# EAGLE design Fox_Sound_Light (EAGLE 9.4.2)
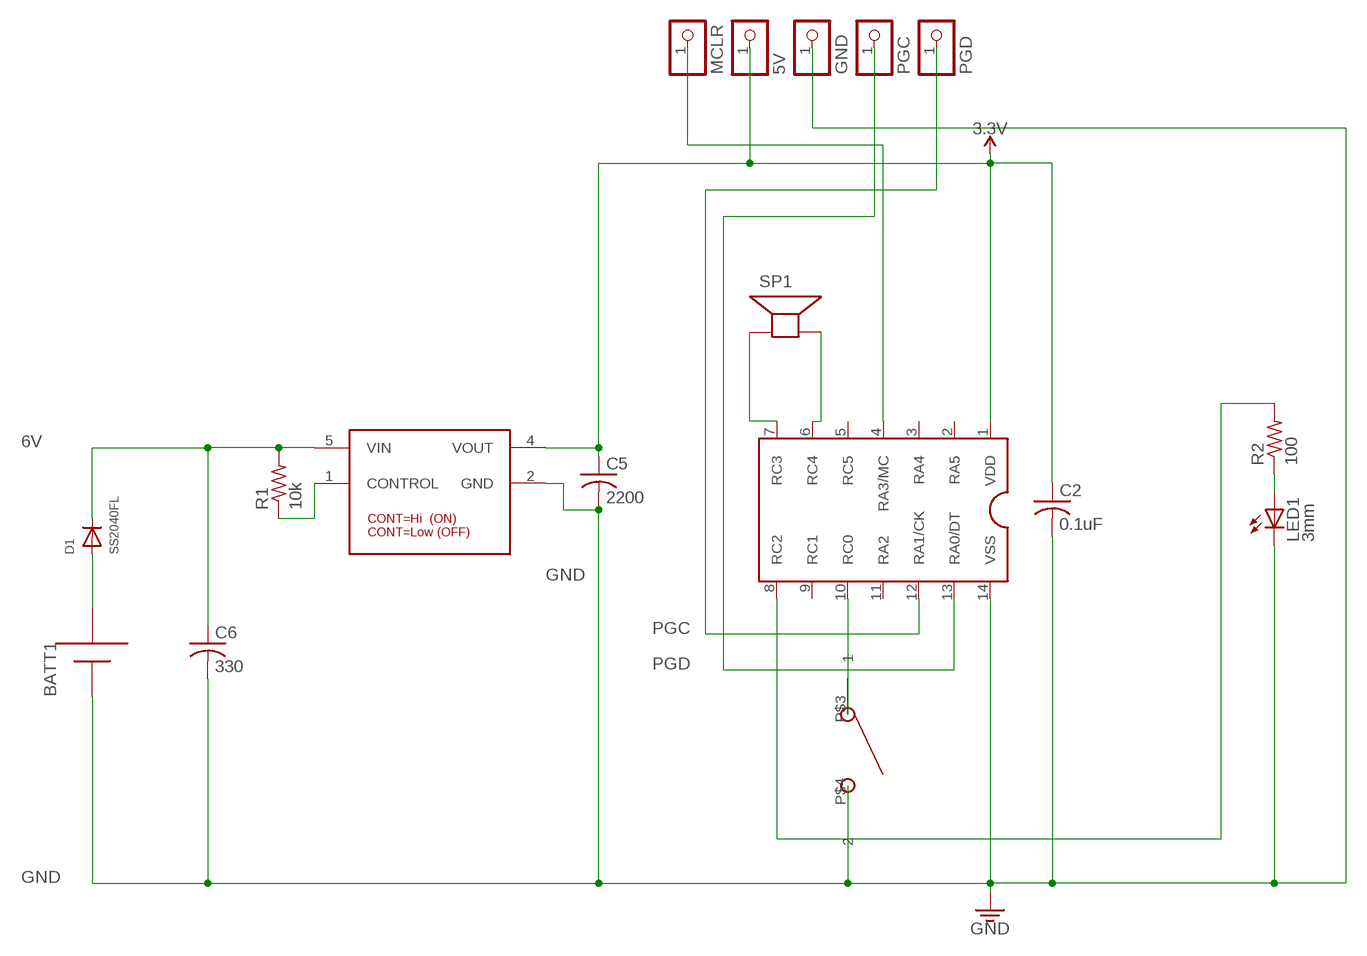
[diagram p0: schematic, sheet 1]

## Parts
BATT1  AAA_CR2032X2  [CR2032X2]
C2  0.1uF  C-USC0603  [C0603]
C5  2200  C-USC3216  [C3216]
C6  330  C-USC0603  [C0603]
D1  SS2040FL  DIODE_SOD-123FL  [SOD-123FL]
JP1  MCLR  PINHD-1X1CB  [1X01-CLEANBIG]
JP2  5V  PINHD-1X1CB  [1X01-CLEANBIG]
JP3  GND  PINHD-1X1CB  [1X01-CLEANBIG]
JP4  PGC  PINHD-1X1CB  [1X01-CLEANBIG]
JP5  PGD  PINHD-1X1CB  [1X01-CLEANBIG]
LED1  3mm  LED3MM  [LED3MM]
NJM2884  NJM2884  I-10673_NJM2884U1-33  [NJM2884U1-33]
R1  10k  R-US_R0603  [R0603]
R2  100  R-US_R0603  [R0603]
SP1  SPEAKER_MURATA  [MURATA_PIEZO]
U$1  LEAD-SWITCH_TILT  [TILT-SWITCH]
U$2  PIC16F1705SOP  [14PIN_SOP]

## Nets
3.3V: C2.1 C5.1 JP2.1 NJM2884.4(VOUT) U$2.1(VDD)
6V: C6.1 D1.C NJM2884.5(VIN) R1.2
GND: BATT1.GND(-) C2.2 C5.2 C6.2 JP3.1 LED1.K(C) NJM2884.2(GND) U$1.P$4 U$2.14(VSS)
N$1: NJM2884.1(CONTROL) R1.1
N$2: LED1.A R2.1
N$3: U$1.P$3 U$2.10(RC0)
N$4: SP1.2(-) U$2.6(RC4)
N$5: SP1.1(+) U$2.7(RC3)
N$6: R2.2 U$2.8(RC2)
N$7: JP1.1 U$2.4(RA3/MC)
N$8: BATT1.V(+) D1.A
PGC: JP5.1 U$2.12(RA1/CK)
PGD: JP4.1 U$2.13(RA0/DT)
Unconnected: U$2.2(RA5) U$2.3(RA4) U$2.5(RC5) U$2.9(RC1) U$2.11(RA2)

## Library data of the parts
BATT1 = MATHRAX-a:AAA: AAA PC pin holder Mouser part #12BH412 - but pretty much any 1x AAA battery holder should be the same http://www.ladyada.net/library/pcb/eaglelibrary.html
C2 C6 = mathrax:C-US: CAPACITOR, American symbol
C5 = MATHRAX-a:C-US: CAPACITOR, American symbol
D1 = MATHRAX-a:DIODE: Diode SMADIODE - SMA Surface Mount Package 20V 1A Schottky Diode Digikey: 641-1014-6-ND DO-1N4148 - Through Hole Small Current Diode SOD-123 20V 1 A (.5mV Vf) Schottky Diode - Digikey: MBRX120TPMSCT-ND SOD-323 10V 570mA (.38mV Vf, 3ns) Schottky Diode - Digikey: ZLLS410CT-ND SOD-523 30V 30mA Schottky Diode (RB751S-40TE61) - Digikey: RB751S-40TE61CT-ND SOT23-R/W - SOT23 Package (R = Solder Paste/Reflow Ovens, W = Hand-Soldering) BAT54Film 40V 300mA - Digikey: 497-7162-1-ND
JP1-JP5 = MATHRAX-a:PINHD-1X1: Pin header 1x1 for 0.1" spacing With round pins
LED1 = MATHRAX-a:LED: LED OSRAM: - CHIPLED LG R971, LG N971, LY N971, LG Q971, LY Q971, LO R971, LY R971 LH N974, LH R974 LS Q976, LO Q976, LY Q976 LO Q996 - Hyper CHIPLED LW Q18S LB Q993, LB Q99A, LB R99A - SideLED LS A670, LO A670, LY A670, LG A670, LP A670 LB A673, LV A673, LT A673, LW A673 LH A674 LY A675 LS A676, LA A676, LO A676, LY A676, LW A676 LS A679, LY A679, LG A679 - Hyper Micro SIDELED® LS Y876, LA Y876, LO Y876, LY Y876 LT Y87S - SmartLED LW L88C, LW L88S LB L89C, LB L89S, LG L890 LS L89K, LO L89K, LY L89K LS L896, LA L896, LO L896, LY L896 - TOPLED LS T670, LO T670, LY T670, LG T670, LP T670 LSG T670, LSP T670, LSY T670, LOP T670, LYG T670 LG T671, LOG T671, LSG T671 LB T673, LV T673, LT T673, LW T673 LH T674 LS T676, LA T676, LO T676, LY T676, LB T676, LH T676, LSB T676, LW T676 LB T67C, LV T67C, LT T67C, LS T67K, LO T67K, LY T67K, LW E67C LS E67B, LA E67B, LO E67B, LY E67B, LB E67C, LV E67C, LT E67C LW T67C LS T679, LY T679, LG T679 LS T770, LO T770, LY T770, LG T770, LP T770 LB T773, LV T773, LT T773, LW T773 LH T774 LS E675, LA E675, LY E675, LS T675 LS T776, LA T776, LO T776, LY T776, LB T776 LHGB T686 LT T68C, LB T68C - Hyper Mini TOPLED® LB M676 - Mini TOPLED Santana® LG M470 LS M47K, LO M47K, LY M47K Source: http://www.osram.convergy.de/
NJM2884 = mathrax:I-10673_NJM2884U1-33
R1 R2 = mathrax:R-US_: RESISTOR, American symbol
SP1 = MATHRAX-a:SPEAKER_MURATA: SPEAKER Source: Buerklin Added PS12 (for part # PS1240 piezo) http://www.ladyada.net/library/pcb/eaglelibrary.html
U$1 = mathrax:LEAD-SWITCH
U$2 = mathrax:PIC16F1705

## Board
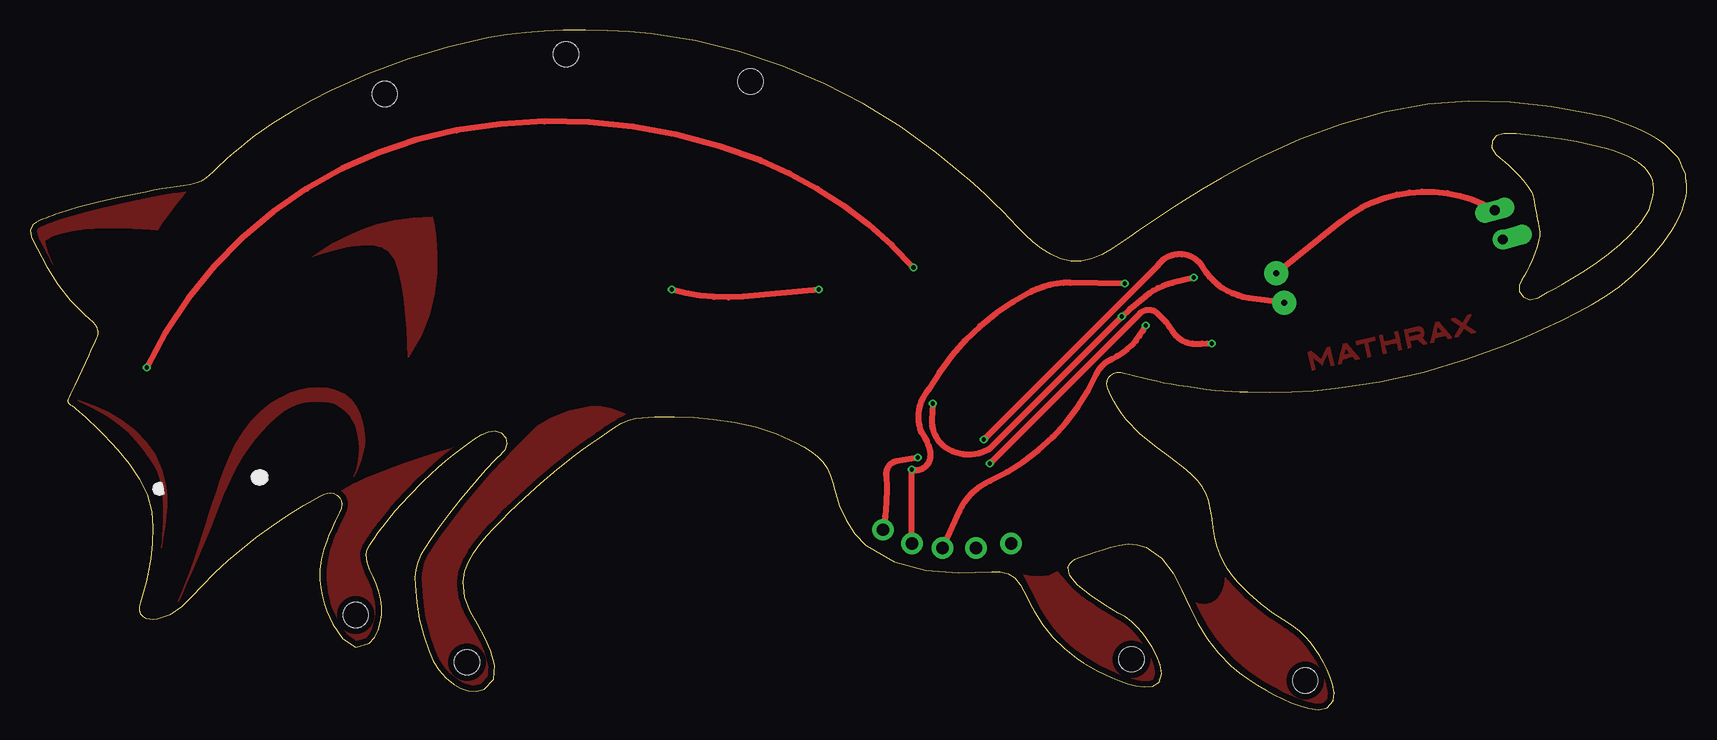
[diagram p1: board, top side]
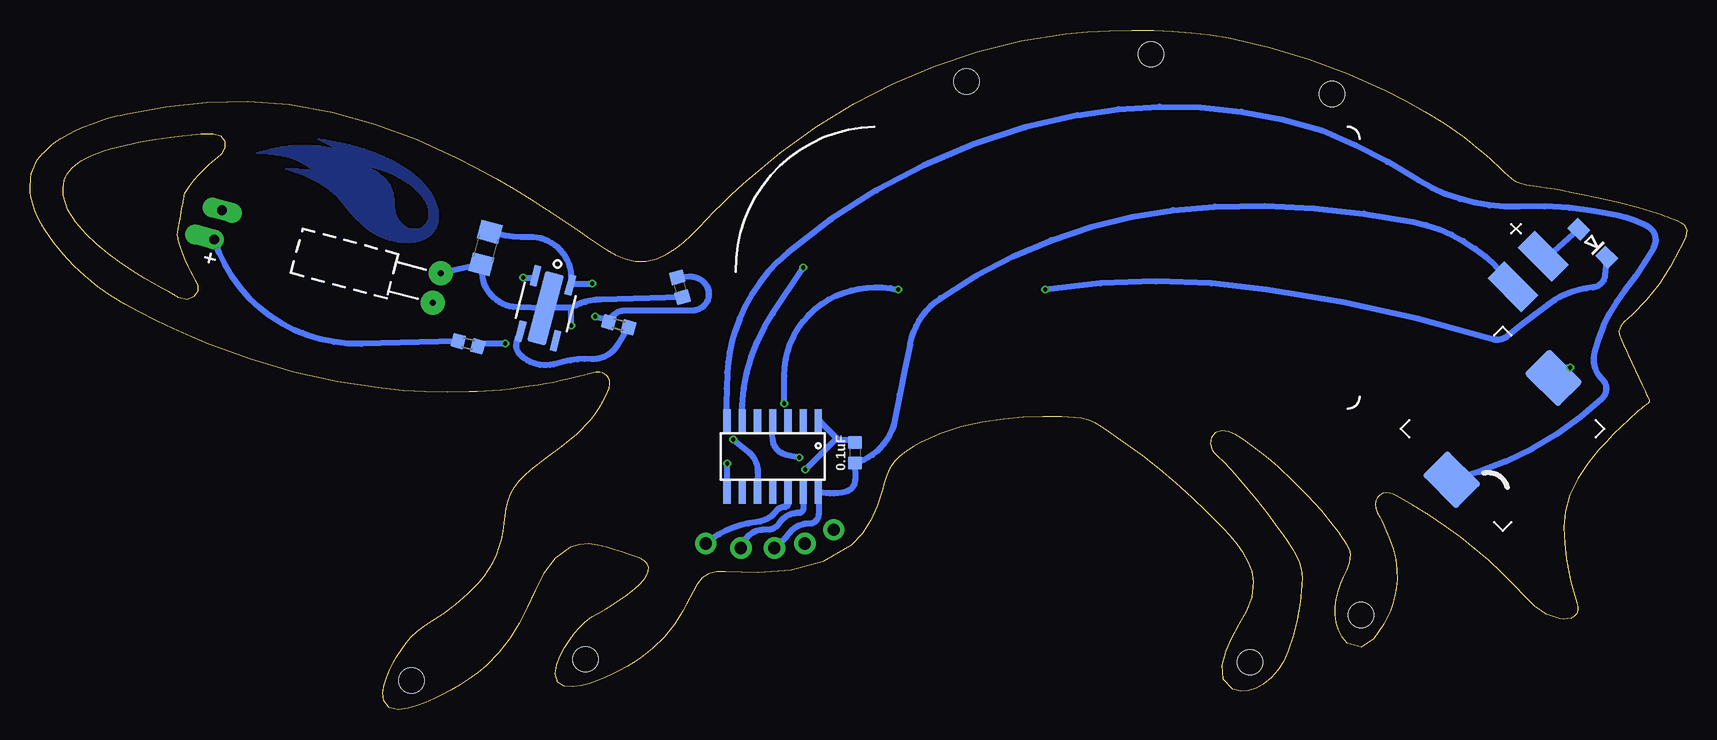
[diagram p2: board, bottom side, seen from below]

Size 138.08 x 56.64 mm. Coordinates in mm from the lower left corner, seen from the top.
Outline: 137.96,44.65 137.83,44.96 137.71,45.26 137.58,45.56 137.42,45.86 137.31,46.02 137.18,46.17 137.04,46.31 136.89,46.45 136.58,46.77 136.26,47.07 135.93,47.35 135.55,47.6 134.9,47.95 134.25,48.27 133.58,48.57 132.89,48.84 132.55,48.97 132.21,49.09 131.88,49.21 131.53,49.32 131.19,49.41 130.85,49.48 130.51,49.55 130.17,49.62 126.78,50.25 123.36,50.63 119.92,50.71 116.48,50.44 112.85,49.77 109.31,48.79 105.85,47.52 102.5,46 100.87,45.17 99.27,44.29 97.69,43.37 96.13,42.41 95.37,41.92 94.61,41.43 93.85,40.93 93.1,40.42 92.35,39.91 91.61,39.38 90.86,38.85 90.1,38.35 89.32,37.9 88.49,37.56 87.62,37.37 86.71,37.37 85.85,37.58 85.05,37.94 84.3,38.41 83.61,38.96 82.94,39.57 82.3,40.22 81.68,40.88 81.05,41.53 80.39,42.18 79.72,42.82 79.04,43.46 78.35,44.08 75.54,46.42 72.56,48.56 69.44,50.48 66.19,52.16 62.73,53.64 59.15,54.84 55.48,55.74 51.76,56.32 49.93,56.49 48.1,56.6 46.26,56.64 44.42,56.61 42.86,56.53 41.29,56.42 39.74,56.24 38.19,55.98 34.82,55.19 31.48,54.2 28.22,53 25.06,51.58 23.42,50.74 21.81,49.85 20.24,48.88 18.74,47.82 18.14,47.36 17.55,46.88 16.96,46.4 16.39,45.9 16.09,45.63 15.8,45.36 15.51,45.09 15.22,44.8 14.93,44.53 14.63,44.27 14.29,44.05 13.92,43.89 13.37,43.76 12.81,43.67 12.24,43.59 11.68,43.51 11,43.39 10.33,43.27 9.65,43.13 8.98,42.99 7.33,42.65 5.68,42.27 4.04,41.85 2.42,41.37 2.15,41.27 1.88,41.17 1.61,41.07 1.34,40.96 1.05,40.85 0.75,40.73 0.47,40.59 0.22,40.41 0,39.97 0.1,39.42 0.35,38.87 0.6,38.42 1.4,36.92 2.32,35.47 3.37,34.11 4.56,32.89 4.9,32.61 5.25,32.3 5.53,31.95 5.66,31.53 5.65,31.32 5.6,31.13 5.53,30.94 5.45,30.76 5.3,30.46 5.16,30.15 5.02,29.85 4.88,29.54 4.3,28.29 4.01,27.66 3.72,27.03 3.61,26.78 3.49,26.54 3.37,26.3 3.25,26.06 3.18,25.92 3.13,25.79 3.14,25.66 3.23,25.54 3.37,25.42 3.52,25.31 3.68,25.2 3.82,25.08 4.08,24.86 4.34,24.63 4.59,24.4 4.84,24.17 5.49,23.57 6.12,22.94 6.73,22.3 7.33,21.64 8.27,20.49 9.11,19.26 9.76,17.92 10.14,16.49 10.24,15.19 10.2,13.87 10.04,12.57 9.81,11.28 9.67,10.68 9.51,10.08 9.34,9.49 9.17,8.89 9.11,8.59 9.1,8.28 9.18,8 9.38,7.77 9.66,7.62 9.96,7.56 10.28,7.55 10.59,7.58 11.72,7.94 12.68,8.62 13.53,9.47 14.34,10.34 15.41,11.41 16.53,12.44 17.68,13.43 18.87,14.37 20.15,15.31 21.47,16.19 22.83,17.03 24.21,17.82 24.48,17.95 24.75,18.05 25.04,18.09 25.33,18.03 25.59,17.89 25.79,17.68 25.93,17.42 25.98,17.13 25.93,16.77 25.79,16.42 25.61,16.08 25.45,15.76 25.26,15.37 25.08,14.97 24.91,14.57 24.75,14.17 24.47,13.36 24.27,12.53 24.16,11.68 24.16,10.82 24.23,10.15 24.34,9.49 24.51,8.83 24.72,8.2 25.25,7.1 26.08,5.93 27.13,5.22 28.29,5.54 28.71,6.03 29.01,6.62 29.21,7.27 29.31,7.9 29.31,8.57 29.22,9.22 29.06,9.86 28.83,10.49 28.58,11.07 28.32,11.67 28.11,12.29 28.03,12.9 28.07,13.21 28.18,13.5 28.34,13.78 28.51,14.04 28.72,14.35 28.93,14.65 29.15,14.95 29.38,15.25 30.45,16.56 31.59,17.82 32.79,19.03 34.03,20.18 34.65,20.73 35.28,21.25 35.92,21.76 36.59,22.24 37.07,22.58 37.61,22.91 38.17,23.15 38.76,23.23 39.29,23.06 39.63,22.66 39.73,22.15 39.55,21.63 39.37,21.41 39.17,21.21 38.96,21.01 38.75,20.81 38.49,20.53 38.23,20.26 37.97,19.97 37.72,19.69 36.77,18.6 35.84,17.48 34.95,16.34 34.08,15.17 33.69,14.62 33.31,14.06 32.94,13.49 32.58,12.91 32.29,12.31 32.13,11.68 32.07,11.04 32.09,10.36 32.23,8.96 32.46,7.55 32.79,6.17 33.25,4.84 33.61,4.05 34.07,3.31 34.63,2.65 35.3,2.11 35.89,1.8 36.54,1.6 37.2,1.55 37.85,1.72 38.64,2.54 38.73,3.69 38.4,4.92 37.95,5.97 37.32,7.1 36.69,8.21 36.22,9.37 36.09,10.67 36.24,11.53 36.55,12.33 36.98,13.09 37.49,13.79 38.07,14.48 38.68,15.15 39.32,15.8 39.95,16.44 41.24,17.68 42.57,18.88 43.94,20.03 45.34,21.14 46.04,21.67 46.74,22.18 47.46,22.68 48.19,23.16 48.72,23.52 49.27,23.87 49.84,24.14 50.47,24.28 52.08,24.39 53.7,24.42 55.31,24.36 56.92,24.22 58.71,23.96 60.49,23.56 62.22,23.01 63.87,22.26 64.47,21.93 65.05,21.56 65.59,21.13 66.07,20.65 66.44,20.11 66.69,19.52 66.88,18.91 67.05,18.27 67.46,17 68,15.78 68.72,14.68 69.66,13.71 72.02,12.31 74.65,11.62 77.41,11.43 80.15,11.5 80.87,11.48 81.51,11.32 82.06,10.98 82.5,10.42 82.8,9.87 83.09,9.32 83.37,8.77 83.67,8.22 84.4,7.08 85.23,6.05 86.17,5.12 87.23,4.28 87.79,3.91 88.36,3.56 88.95,3.24 89.56,2.95 90.18,2.67 90.82,2.41 91.47,2.18 92.14,1.99 92.85,1.9 93.57,1.96 94.11,2.29 94.32,2.99 94.19,3.75 93.9,4.49 93.52,5.19 93.1,5.84 92.71,6.38 92.28,6.89 91.8,7.34 91.26,7.73 90.7,8.05 90.15,8.38 89.61,8.71 89.07,9.06 88.48,9.47 87.89,9.9 87.33,10.38 86.85,10.9 86.66,11.19 86.55,11.52 86.53,11.85 86.65,12.17 86.84,12.39 87.08,12.55 87.34,12.66 87.61,12.75 88.21,12.95 88.81,13.14 89.41,13.33 90.01,13.52 90.77,13.71 91.53,13.81 92.29,13.76 93.04,13.52 94.31,12.61 95.26,11.37 95.99,9.96 96.63,8.54 97.3,7.2 98.09,5.92 99,4.73 100.06,3.66 100.76,3.09 101.48,2.56 102.24,2.08 103.02,1.62 103.71,1.25 104.41,0.9 105.12,0.59 105.85,0.31 106.57,0.1 107.39,0 108.12,0.16 108.58,0.75 108.67,1.4 108.57,2.07 108.36,2.72 108.09,3.32 107.79,3.91 107.47,4.49 107.11,5.05 106.72,5.59 106.29,6.08 105.81,6.52 105.3,6.91 104.75,7.27 103.65,8 102.59,8.79 101.59,9.65 100.67,10.6 100.23,11.13 99.83,11.7 99.48,12.29 99.18,12.92 98.95,13.56 98.78,14.21 98.65,14.88 98.54,15.55 98.46,16.17 98.37,16.8 98.23,17.41 98.01,18 97.69,18.57 97.3,19.08 96.85,19.55 96.37,19.98 95.07,20.99 93.75,21.95 92.48,22.98 91.35,24.17 90.99,24.65 90.66,25.15 90.35,25.67 90.07,26.21 89.94,26.49 89.82,26.8 89.75,27.11 89.78,27.43 89.89,27.68 90.07,27.89 90.31,28.03 90.58,28.11 90.91,28.11 91.25,28.04 91.58,27.95 91.91,27.87 92.25,27.79 92.59,27.71 92.93,27.63 93.27,27.55 93.88,27.4 94.49,27.26 95.1,27.14 95.72,27.04 96.49,26.94 97.25,26.83 98.02,26.72 98.79,26.63 99.46,26.56 100.13,26.52 100.81,26.5 101.48,26.47 103.31,26.45 105.13,26.49 106.96,26.6 108.78,26.77 112.46,27.33 116.09,28.14 119.66,29.19 123.16,30.46 124.65,31.08 126.12,31.73 127.57,32.41 129.01,33.15 130.19,33.8 131.34,34.49 132.44,35.25 133.49,36.12 134.41,37.01 135.29,37.94 136.11,38.93 136.84,39.99 137.14,40.51 137.42,41.06 137.67,41.62 137.87,42.19 137.95,42.49 138.01,42.8 138.06,43.11 138.08,43.42 138.07,43.73 138.03,44.04 137.99,44.34 137.96,44.65
Outline: 135.24,44.12 135.1,44.41 134.95,44.68 134.78,44.93 134.56,45.17 134.32,45.38 134.06,45.56 133.79,45.73 133.51,45.89 133,46.15 132.47,46.38 131.93,46.58 131.38,46.74 130.15,47.06 128.91,47.31 127.66,47.52 126.4,47.69 125.39,47.82 124.61,47.93 123.84,47.99 122.82,48.01 122.2,47.83 121.86,47.38 121.83,46.81 122.15,46.27 122.48,45.98 122.68,45.83 122.89,45.67 123.22,45.38 123.64,44.97 124.05,44.55 124.44,44.1 124.8,43.64 124.89,43.51 124.97,43.39 125.06,43.26 125.14,43.14 125.2,43 125.24,42.87 125.27,42.73 125.3,42.58 125.35,42.3 125.46,41.73 125.51,41.44 125.56,41.15 125.62,40.85 125.67,40.56 125.73,40.26 125.75,40.13 125.78,40 125.8,39.87 125.82,39.74 125.83,39.59 125.81,39.45 125.78,39.31 125.75,39.16 125.59,38.6 125.39,38.05 125.17,37.51 124.94,36.97 124.71,36.52 124.52,36.17 124.33,35.83 124.1,35.38 124.09,34.89 124.42,34.41 124.98,34.15 125.67,34.31 126.52,34.81 127.11,35.13 127.7,35.45 128.54,35.95 129.57,36.59 130.59,37.27 131.57,37.99 132.5,38.78 133.41,39.64 134.26,40.6 134.93,41.67 135.29,42.87 135.31,43.19 135.31,43.49 135.28,43.79 135.24,44.12
Copper layers (1*16): Top 0.035mm / dielectric 1.6mm / Bottom 0.035mm
Design rules "PCBGOGO_2-layer_PCB_eagle_rule": minimum track width 6mil, minimum drill 0.35mm, track to track 6mil, track to pad 6mil, pad to pad 6mil, via to via 8mil, smd to smd 0mil, copper to edge 20mil, drill to drill 10mil, minimum pad ring 6mil, minimum via ring 6mil, stop-mask expansion 0mil, vias tented up to drill 100mil, thermal gap 10mil
Holes 2.1 mm at 27.15,7.89 36.42,3.95 106.27,2.43 44.67,54.62 60.04,52.34 29.56,51.32 91.79,4.2

### Footprints (pad centres in the part's own frame; a part is rotated, then mirrored left to right if it is on the bottom)
CR2032X2 = smd 4 x 2 rotated 315: GND 64.77,10.16; V 67.31,12.7
C0603 = smd 1.1 x 1.2: 1 -0.85,0; 2 0.85,0
C3216 = smd 1.6 x 1.8: 1 -1.4,0; 2 1.4,0
SOD-123FL = smd 1.5 x 1.22: A 1.637,0; C -1.637,0
1X01-CLEANBIG = drill 1.016 pad 1.778: 1 0,0
LED3MM = drill 0.813 pad 1.676 offset: A -1.27,0 | drill 0.813 pad 1.676 long: K 1.27,0
NJM2884U1-33 = smd 0.6 x 1.8: 1 -1.5,-2.4; 3 1.5,-2.4; 4 1.5,2.4; 5 -1.5,2.4 | smd 1.6 x 6: 2 0,0
R0603 = smd 1.1 x 1.2: 1 -0.85,0; 2 0.85,0
MURATA_PIEZO = smd 3 x 4: 1 -6,0; 2 6,0
TILT-SWITCH = drill 0.5 pad 2: P$3 -1.27,0; P$4 1.27,0
14PIN_SOP = smd 0.6 x 2: 1 -3.81,-2.925; 2 -2.54,-2.925; 3 -1.27,-2.925; 4 0,-2.925; 5 1.27,-2.925; 6 2.54,-2.925; 7 3.81,-2.925; 8 3.81,2.925; 9 2.54,2.925; 10 1.27,2.925; 11 0,2.925; 12 -1.27,2.925; 13 -2.54,2.925; 14 -3.81,2.925

### Placement (x,y rotation side)
BATT1  79.27,25.08 0 bottom
C2  69.33,21.42 270 bottom
C5  100.11,38.46 255 bottom
C6  83.92,35.2 285 bottom
D1  7.84,38.88 135 bottom
JP1  71.09,15 0 top
JP2  73.5,13.86 0 top
JP3  76.04,13.48 0 top
JP4  78.84,13.48 0 top
JP5  81.76,13.86 0 top
LED1  122.4,40.4 75 bottom
NJM2884  95.12,33.46 345 bottom
R1  89.03,32.08 165 bottom
R2  101.57,30.49 345 bottom
SP1  15.36,23.41 45 bottom
U$1  104.19,35.13 75 bottom
U$2  76.19,21.09 180 bottom

### Tracks (layer width: path | path; a pad name or v marks a point on that pad's centre or on a via)
3.3V  (via drill 0.35)
  Top 0.5: JP2.1 73.47,14.01 v73.47,20.01 arc119 75.03,21.48 arc24 74.27,23.13 arc-64 74.9,26.68 arc-34 83.41,34.81 arc-28 86.71,35.57 v91.22,35.51
  Bottom 0.5: 70.85,22.64 72.22,24.01 U$2.1 | 70.85,22.64 70.72,22.51 69.47,22.51 C2.1 | v73.47,20.01 70.85,22.64 | v91.22,35.51 92.72,35.51 NJM2884.4 92.97,35.51 arc-99 96.49,39.38 arc18 C5.1
6V  (via drill 0.35)
  Top 0.5: v65.72,35.01 59.41,34.43 arc-22 v53.47,35.01 | v96.97,36.01 95.22,35.57 arc25 92.93,34.43 arc3 v90.97,32.76 79.97,21.76 arc-65 76.3,21.86 arc-59 75.15,24.14 v75.22,25.51
  Bottom 0.5: 89.72,32.51 R1.2 | v96.97,36.01 95.97,36.01 NJM2884.5 | v53.47,35.01 arc17 35.02,35.01 arc9 16.23,30.87 arc-57 14.96,31.13 arc3 11.53,33.8 arc31 7.84,35.19 arc-79 6.83,36.21 D1.C | v75.22,25.51 75.22,27.8 arc72 70.27,34.74 arc31 v65.72,35.01 | 89.72,32.51 arc62 88.47,33.26 82.97,33.26 arc-137 81.89,35.57 arc-50 83.16,36.08 C6.1 | v90.97,32.76 89.72,32.51
FIRE
  pour Bottom: 106.56,40.13 106.67,40.18 106.77,40.24 106.87,40.31 106.97,40.39 107.08,40.49 107.18,40.6 107.28,40.72 107.37,40.86 107.58,41.35 107.66,41.9 107.71,42.47 107.81,43.07 108.03,43.67 108.46,44.27 109.18,44.83 110.27,45.35 110.18,45.34 109.93,45.29 109.54,45.2 109.04,45.06 108.47,44.87 107.85,44.61 107.2,44.29 106.56,43.88 106.56,44.01 106.56,44.15 106.56,44.29 106.56,44.42 106.56,44.56 106.56,44.69 106.56,44.83 106.56,44.96 107.78,45.71 109.05,46.29 110.31,46.75 111.5,47.08 112.54,47.3 113.37,47.44 113.92,47.52 114.11,47.54 113.84,47.41 113.6,47.3 113.39,47.2 113.21,47.11 113.04,47.02 112.88,46.93 112.71,46.82 112.53,46.7 113.84,46.94 115.08,47.03 116.22,46.99 117.22,46.87 118.05,46.7 118.68,46.53 119.08,46.4 119.23,46.35 118.2,46.32 117.34,46.22 116.62,46.06 116.01,45.85 115.5,45.61 115.04,45.35 114.63,45.09 114.23,44.83 114.75,44.93 115.24,45 115.68,45.05 116.06,45.07 116.38,45.08 116.62,45.08 116.77,45.08 116.82,45.08 115.23,44.52 114.04,43.95 113.16,43.37 112.51,42.79 112,42.21 111.56,41.64 111.1,41.07 110.52,40.52 110.31,40.33 110.08,40.15 109.85,39.97 109.6,39.81 109.33,39.65 109.06,39.51 108.78,39.37 108.49,39.25 108.24,39.17 107.99,39.11 107.74,39.05 107.49,39 107.25,38.97 107.02,38.94 106.79,38.93 106.56,38.93 106.56,39.08 106.56,39.23 106.56,39.38 106.56,39.53 106.56,39.68 106.56,39.83 106.56,39.98
  pour Bottom: 104.61,42.98 104.81,43.27 105.02,43.54 105.25,43.81 105.49,44.06 105.74,44.3 106,44.53 106.27,44.74 106.54,44.95 106.54,44.81 106.54,44.68 106.54,44.54 106.54,44.41 106.54,44.27 106.54,44.14 106.54,44 106.54,43.86 106.36,43.72 106.18,43.58 106,43.42 105.83,43.26 105.67,43.08 105.51,42.9 105.36,42.71 105.22,42.51 105.18,42.44 105.08,42.26 104.97,42 104.87,41.66 104.83,41.29 104.88,40.9 105.06,40.52 105.41,40.17 105.43,40.16 105.5,40.13 105.61,40.09 105.75,40.06 105.92,40.04 106.11,40.03 106.32,40.06 106.54,40.12 106.54,39.98 106.54,39.83 106.54,39.68 106.54,39.53 106.54,39.38 106.54,39.23 106.54,39.08 106.54,38.93 106.08,38.97 105.65,39.05 105.26,39.19 104.91,39.38 104.61,39.61 104.37,39.89 104.18,40.22 104.05,40.6 104,41.03 104.02,41.46 104.11,41.86 104.23,42.22 104.36,42.53 104.49,42.77 104.58,42.93
GND  (via drill 0.35)
  Top 0.5: U$1.P$4 109.19,40.65 arc-69 LED1.K | JP3.1 77.44,16.52 arc-41 79.98,19.06 arc41 88.87,27.95 arc-41 90.14,29.22 arc40 v92.97,32.01
  Bottom 0.5: v92.97,32.01 92.97,33.51 | C6.2 90.52,34.18 arc-27 92.97,33.51 | U$1.P$4 C5.2 100.22,37.51 arc-107 97.51,33.54 NJM2884.2 94.97,33.51 92.97,33.51 | JP3.1 arc-17 74.9,14.62 arc54 73.12,15.51 arc-91 72.36,16.27 U$2.14 arc-31 70.07,18.17 arc-75 69.31,19.19 C2.2 69.47,20.51 arc-66 66.01,24.14 arc1 64.74,30.49 arc44 62.2,34.3 arc32 39.34,41.92 arc14 22.83,40.65 arc43 BATT1.GND
LOGO
  pour Top: 110.05,29.68 109.95,29.8 109.84,29.92 109.74,30.05 109.64,30.17 109.62,30.25 109.6,30.33 109.58,30.41 109.56,30.49 109.6,30.5 109.63,30.51 109.67,30.51 109.7,30.52 109.71,30.52 109.72,30.52 109.73,30.52 109.74,30.51 110,30.2 110.25,29.89 110.51,29.58 110.77,29.27 110.77,29.26 110.78,29.25 110.78,29.24 110.78,29.23 110.77,29.23 110.76,29.22 110.76,29.21 110.75,29.21 110.69,29.2 110.63,29.18 110.57,29.17 110.51,29.15 110.5,29.15 110.49,29.16 110.48,29.16 110.47,29.17 110.42,29.23 110.36,29.3 110.31,29.36 110.26,29.43 110.15,29.4 110.04,29.38 109.94,29.35 109.83,29.33 109.81,29.4 109.8,29.47 109.78,29.54 109.77,29.61 109.84,29.63 109.91,29.64 109.98,29.66
  pour Top: 116.4,30.57 116.29,30.68 116.18,30.78 116.07,30.89 115.95,31 116.01,31.03 116.06,31.08 116.11,31.12 116.14,31.18 116.14,31.18 116.14,31.18 116.14,31.18 116.14,31.18 116.17,31.25 116.19,31.33 116.19,31.42 116.18,31.51 116.15,31.61 116.1,31.7 116.04,31.77 115.97,31.83 115.88,31.87 115.79,31.89 115.69,31.89 115.58,31.88 115.48,31.85 115.37,31.83 115.27,31.81 115.16,31.78 115.18,31.71 115.2,31.64 115.21,31.57 115.23,31.5 115.32,31.52 115.41,31.54 115.5,31.56 115.59,31.58 115.65,31.59 115.71,31.6 115.75,31.59 115.79,31.58 115.82,31.56 115.84,31.53 115.86,31.49 115.88,31.44 115.89,31.4 115.88,31.36 115.88,31.32 115.86,31.3 115.83,31.27 115.8,31.25 115.76,31.23 115.7,31.21 115.6,31.19 115.51,31.17 115.41,31.14 115.32,31.12 115.33,31.05 115.35,30.98 115.36,30.91 115.38,30.84 115.44,30.85 115.5,30.87 115.56,30.88 115.62,30.9 115.74,30.79 115.86,30.68 115.97,30.57 116.09,30.46 116.1,30.45 116.11,30.45 116.12,30.45 116.13,30.45 116.19,30.46 116.25,30.48 116.32,30.49 116.38,30.51 116.39,30.51 116.4,30.52 116.41,30.53 116.41,30.53 116.41,30.54 116.41,30.55 116.41,30.56
  pour Top: 113.94,31.5 113.88,31.49 113.83,31.47 113.78,31.46 113.73,31.45 113.73,31.45 113.72,31.45 113.72,31.44 113.71,31.44 113.71,31.43 113.71,31.42 113.71,31.41 113.71,31.41 113.74,31.27 113.77,31.14 113.8,31.01 113.83,30.87 113.58,30.82 113.34,30.76 113.09,30.7 112.85,30.65 112.82,30.78 112.79,30.91 112.76,31.05 112.73,31.18 112.72,31.19 112.72,31.19 112.72,31.2 112.71,31.2 112.7,31.21 112.7,31.21 112.69,31.21 112.68,31.21 112.63,31.2 112.58,31.18 112.52,31.17 112.47,31.16 112.47,31.16 112.46,31.16 112.46,31.16 112.46,31.15 112.44,31.14 112.43,31.12 112.43,31.1 112.43,31.08 112.51,30.74 112.59,30.4 112.67,30.05 112.74,29.71 112.75,29.7 112.75,29.7 112.76,29.69 112.76,29.68 112.77,29.68 112.77,29.68 112.78,29.68 112.79,29.68 112.85,29.69 112.91,29.71 112.96,29.72 113.02,29.73 113.03,29.74 113.04,29.74 113.04,29.74 113.05,29.75 113.05,29.76 113.05,29.76 113.05,29.77 113.05,29.78 113.02,29.93 112.98,30.07 112.95,30.22 112.91,30.37 113.16,30.42 113.4,30.48 113.65,30.54 113.89,30.59 113.93,30.45 113.96,30.3 114,30.15 114.03,30 114.03,30 114.04,29.99 114.04,29.99 114.05,29.98 114.05,29.98 114.06,29.98 114.07,29.98 114.07,29.98 114.13,29.99 114.19,30 114.24,30.02 114.3,30.03 114.31,30.03 114.31,30.03 114.32,30.04 114.32,30.05 114.33,30.05 114.33,30.06 114.33,30.07 114.33,30.07 114.25,30.42 114.17,30.76 114.09,31.11 114.01,31.45 114.01,31.45 114.01,31.46 114.01,31.46 114.01,31.46 114,31.48 113.98,31.49 113.96,31.5
  pour Top: 111.99,31.05 111.63,30.97 111.27,30.88 110.91,30.8 110.54,30.72 110.52,30.71 110.5,30.69 110.5,30.66 110.5,30.64 110.51,30.59 110.52,30.55 110.53,30.5 110.54,30.46 110.54,30.45 110.54,30.44 110.55,30.44 110.55,30.43 110.56,30.43 110.57,30.43 110.58,30.43 110.58,30.43 110.73,30.46 110.88,30.5 111.03,30.53 111.19,30.57 111.25,30.28 111.32,29.99 111.39,29.7 111.45,29.41 111.45,29.4 111.46,29.4 111.46,29.39 111.47,29.39 111.47,29.38 111.48,29.38 111.49,29.38 111.5,29.38 111.55,29.4 111.61,29.41 111.66,29.42 111.72,29.43 111.72,29.44 111.73,29.44 111.74,29.44 111.74,29.45 111.74,29.46 111.75,29.46 111.75,29.47 111.75,29.48 111.68,29.77 111.61,30.06 111.55,30.35 111.48,30.64 111.63,30.67 111.78,30.71 111.93,30.74 112.08,30.77 112.09,30.78 112.09,30.78 112.1,30.79 112.1,30.79 112.11,30.8 112.11,30.8 112.11,30.81 112.11,30.82 112.1,30.86 112.09,30.91 112.08,30.95 112.07,31 112.06,31.02 112.04,31.04 112.02,31.05
  pour Top: 108.27,30.19 108.21,30.18 108.15,30.17 108.09,30.15 108.03,30.14 108.02,30.13 108.02,30.13 108.01,30.12 108.01,30.12 107.91,29.88 107.8,29.64 107.7,29.41 107.6,29.17 107.41,29.34 107.21,29.51 107.02,29.68 106.82,29.84 106.81,29.85 106.81,29.85 106.8,29.85 106.79,29.85 106.77,29.85 106.71,29.83 106.64,29.82 106.58,29.8 106.57,29.8 106.56,29.8 106.56,29.8 106.55,29.8 106.52,29.78 106.51,29.77 106.5,29.74 106.5,29.72 106.58,29.37 106.66,29.03 106.74,28.69 106.82,28.34 106.82,28.34 106.82,28.33 106.83,28.32 106.83,28.32 106.84,28.32 106.85,28.31 106.85,28.31 106.86,28.31 106.91,28.33 106.97,28.34 107.02,28.35 107.08,28.36 107.08,28.37 107.09,28.37 107.09,28.37 107.1,28.38 107.1,28.39 107.1,28.39 107.1,28.4 107.1,28.41 107.04,28.66 106.99,28.92 106.93,29.17 106.87,29.43 107.07,29.25 107.27,29.08 107.47,28.91 107.67,28.73 107.68,28.73 107.69,28.72 107.69,28.72 107.7,28.72 107.71,28.73 107.72,28.73 107.72,28.74 107.73,28.75 107.83,28.99 107.94,29.23 108.04,29.47 108.15,29.72 108.21,29.46 108.26,29.21 108.32,28.96 108.38,28.7 108.38,28.7 108.39,28.69 108.39,28.68 108.4,28.68 108.4,28.68 108.41,28.67 108.42,28.67 108.43,28.67 108.48,28.69 108.53,28.7 108.59,28.71 108.64,28.72 108.65,28.73 108.65,28.73 108.66,28.74 108.66,28.74 108.67,28.75 108.67,28.75 108.67,28.76 108.67,28.77 108.59,29.11 108.51,29.46 108.43,29.8 108.35,30.14 108.34,30.17 108.32,30.18 108.3,30.19
  pour Top: 120.44,31.51 120.24,31.64 120.03,31.78 119.83,31.91 119.63,32.04 119.75,32.25 119.87,32.45 119.99,32.65 120.11,32.86 120.11,32.87 120.11,32.88 120.11,32.89 120.11,32.9 120.1,32.9 120.09,32.91 120.08,32.91 120.07,32.91 119.99,32.89 119.92,32.88 119.85,32.86 119.78,32.84 119.77,32.84 119.77,32.84 119.76,32.83 119.76,32.83 119.66,32.67 119.57,32.51 119.48,32.35 119.39,32.2 119.24,32.3 119.08,32.4 118.93,32.5 118.78,32.6 118.77,32.61 118.77,32.61 118.76,32.61 118.75,32.61 118.68,32.59 118.61,32.57 118.54,32.56 118.46,32.54 118.45,32.54 118.44,32.53 118.44,32.52 118.44,32.51 118.43,32.5 118.44,32.49 118.44,32.48 118.45,32.47 118.65,32.34 118.84,32.21 119.04,32.08 119.24,31.95 119.11,31.74 118.99,31.53 118.86,31.32 118.74,31.12 118.74,31.11 118.73,31.1 118.74,31.08 118.74,31.07 118.75,31.07 118.76,31.06 118.77,31.06 118.78,31.06 118.85,31.08 118.92,31.09 119,31.11 119.07,31.13 119.07,31.13 119.08,31.13 119.09,31.14 119.09,31.14 119.19,31.31 119.28,31.47 119.38,31.64 119.48,31.8 119.64,31.7 119.8,31.59 119.96,31.49 120.11,31.38 120.12,31.38 120.13,31.37 120.14,31.37 120.14,31.37 120.21,31.39 120.29,31.41 120.36,31.42 120.43,31.44 120.44,31.45 120.45,31.45 120.46,31.46 120.46,31.47 120.46,31.48 120.46,31.49 120.45,31.5
  pour Top: 117.39,32.29 117.36,32.29 117.32,32.28 117.29,32.27 117.25,32.26 117.27,32.18 117.29,32.1 117.31,32.02 117.33,31.94 117.33,31.94 117.33,31.94 117.33,31.94 117.33,31.94 117.33,31.94 117.33,31.94 117.33,31.94 117.33,31.95 117.43,31.82 117.53,31.7 117.64,31.57 117.74,31.45 117.67,31.43 117.6,31.42 117.53,31.4 117.46,31.38 117.47,31.31 117.49,31.24 117.5,31.17 117.52,31.1 117.63,31.13 117.73,31.15 117.84,31.18 117.95,31.2 118,31.13 118.05,31.07 118.11,31 118.16,30.94 118.17,30.93 118.18,30.93 118.19,30.93 118.2,30.93 118.26,30.94 118.32,30.95 118.38,30.97 118.44,30.98 118.45,30.99 118.46,30.99 118.46,31 118.47,31.01 118.47,31.02 118.47,31.02 118.46,31.03 118.46,31.04 118.2,31.35 117.94,31.66 117.69,31.97 117.43,32.28 117.42,32.29 117.41,32.29 117.4,32.3
  pour Top: 109.76,29.61 109.69,29.59 109.62,29.58 109.55,29.56 109.48,29.55 109.52,29.7 109.56,29.85 109.59,30 109.63,30.15 109.61,30.23 109.59,30.32 109.57,30.4 109.55,30.49 109.52,30.48 109.49,30.47 109.46,30.47 109.42,30.46 109.41,30.45 109.41,30.45 109.4,30.44 109.4,30.43 109.3,30.04 109.2,29.65 109.11,29.26 109.01,28.86 109.01,28.86 109.01,28.85 109.02,28.84 109.02,28.83 109.03,28.82 109.04,28.82 109.05,28.82 109.06,28.82 109.12,28.83 109.18,28.85 109.24,28.86 109.3,28.88 109.31,28.88 109.32,28.89 109.32,28.89 109.33,28.9 109.35,28.99 109.36,29.07 109.38,29.15 109.4,29.23 109.51,29.25 109.61,29.28 109.72,29.3 109.82,29.33 109.8,29.4 109.79,29.47 109.77,29.54
  pour Top: 115.31,31.12 115.21,31.1 115.12,31.08 115.03,31.06 114.94,31.03 114.92,31.13 114.89,31.22 114.87,31.32 114.85,31.41 114.94,31.43 115.03,31.46 115.13,31.48 115.22,31.5 115.2,31.57 115.19,31.64 115.17,31.71 115.15,31.78 115,31.74 114.85,31.71 114.7,31.68 114.55,31.64 114.53,31.63 114.51,31.61 114.51,31.59 114.51,31.56 114.59,31.22 114.67,30.87 114.74,30.53 114.82,30.19 114.83,30.18 114.83,30.17 114.83,30.17 114.84,30.16 114.85,30.16 114.85,30.16 114.86,30.16 114.87,30.16 114.92,30.17 114.98,30.18 115.03,30.2 115.09,30.21 115.1,30.21 115.1,30.22 115.11,30.22 115.11,30.23 115.12,30.23 115.12,30.24 115.12,30.25 115.12,30.25 115.09,30.38 115.06,30.5 115.03,30.63 115,30.75 115.09,30.77 115.19,30.8 115.28,30.82 115.37,30.84 115.36,30.91 115.34,30.98 115.32,31.05
  pour Top: 117.45,31.38 117.38,31.37 117.31,31.35 117.24,31.33 117.17,31.32 117.21,31.47 117.25,31.62 117.28,31.77 117.32,31.92 117.3,32.01 117.28,32.09 117.26,32.18 117.24,32.26 117.21,32.25 117.18,32.25 117.15,32.24 117.11,32.23 117.1,32.23 117.1,32.22 117.09,32.21 117.09,32.2 116.99,31.81 116.89,31.42 116.8,31.03 116.7,30.64 116.7,30.63 116.7,30.62 116.71,30.61 116.71,30.6 116.72,30.6 116.73,30.59 116.74,30.59 116.75,30.59 116.81,30.61 116.87,30.62 116.93,30.63 116.99,30.65 117,30.65 117.01,30.66 117.01,30.67 117.02,30.68 117.04,30.76 117.06,30.84 117.07,30.92 117.09,31 117.2,31.03 117.3,31.05 117.41,31.08 117.51,31.1 117.5,31.17 117.48,31.24 117.46,31.31
N$1
  Bottom 0.5: NJM2884.1 97.22,31.51 arc-3 97.51,30.62 arc-61 97.25,29.6 arc-63 94.2,28.84 arc20 91.28,29.22 arc-61 89.12,30.37 R1.1
N$2
  Bottom 0.5: R2.1 110.46,30.49 arc74 LED1.A
N$3  (via drill 0.35)
  Top 0.5: v79.47,22.51 93.97,37.01 arc-114 97.76,36.84 arc52 101.57,34.3 U$1.P$3
  Bottom 0.5: U$2.10 77.47,18.26 arc0 77.44,19.83 arc-52 78.2,21.48 v79.47,22.51
N$4  (via drill 0.35)
  Top 0.5: v73.63,36.84 arc26 60.93,45.73 arc32 35.53,48.27 arc54 v9.72,28.51
  Bottom 0.5: v9.72,28.51 10.28,28.51 SP1.2 | U$2.6 arc36 76.17,33.03 v73.63,36.84
N$5
  Bottom 0.5: 79.99,24.14 79.97,24.76 79.97,24.26 U$2.7 79.99,24.14 | 79.99,24.14 arc6 79.98,28.08 arc15 79.35,31.51 arc32 74.9,38.11 arc29 50.77,49.54 arc29 30.45,48.27 arc11 22.32,44.08 arc-33 13.94,41.92 arc15 5.69,41.16 arc15 3.27,40.27 arc93 2.76,38.49 arc8 5.18,34.94 arc-24 7.72,29.73 arc-61 7.08,27.57 arc94 7.08,25.92 arc30 SP1.1
N$6  (via drill 0.35)
  Top 0.5: v79.97,20.51 92.47,33.01 arc-88 93.95,33.03 arc-13 95.22,31.51 arc61 97.25,30.49 arc-6 v98.47,30.51
  Bottom 0.5: v98.47,30.51 100.47,30.51 R2.2 | v79.97,20.51 79.97,18.51 U$2.8
N$7  (via drill 0.35)
  Top 0.5: v73.97,21.01 72.23,20.71 arc85 71.34,19.57 arc-15 JP1.1
  Bottom 0.5: v73.97,21.01 75.03,21.22 arc74 76.17,22.49 arc9 U$2.4
N$8
  Bottom 0.5: BATT1.V 11.52,37.78 D1.A
NC1
  pour Top: 31.51,29.37 31.48,30.45 31.42,31.68 31.32,32.99 31.18,34.29 31,35.52 30.75,36.61 30.43,37.48 30.03,38.05 29.92,38.15 29.79,38.25 29.65,38.35 29.47,38.44 29.27,38.52 29.04,38.59 28.78,38.65 28.47,38.69 28.03,38.7 27.54,38.68 26.99,38.62 26.41,38.52 25.77,38.38 25.08,38.2 24.35,37.98 23.58,37.73 24.39,38.31 25.33,38.9 26.4,39.47 27.6,40 28.91,40.45 30.34,40.8 31.88,41.01 33.52,41.07 33.67,40.34 33.81,39.27 33.91,37.94 33.89,36.39 33.69,34.7 33.27,32.93 32.56,31.13
NC2
  pour Top: 1.89,37.1 1.6,37.59 1.35,38.05 1.14,38.46 0.96,38.83 0.81,39.13 0.71,39.36 0.64,39.53 0.61,39.6 0.59,39.64 0.57,39.69 0.55,39.74 0.53,39.79 0.51,39.85 0.49,39.9 0.48,39.95 0.47,39.98 0.56,40.05 0.7,40.13 0.89,40.23 1.13,40.33 1.4,40.44 1.71,40.57 2.04,40.7 2.4,40.84 2.41,40.85 2.42,40.85 2.43,40.85 2.44,40.86 2.45,40.86 2.46,40.86 2.47,40.87 2.48,40.87 2.82,40.97 3.54,41.17 4.6,41.45 5.94,41.79 7.5,42.16 9.25,42.54 11.12,42.9 13.06,43.23 12.6,42.68 12.18,42.16 11.8,41.67 11.47,41.22 11.19,40.82 10.95,40.48 10.76,40.18 10.61,39.95 10.53,39.96 10.46,39.97 10.39,39.97 10.31,39.98 10.24,39.99 10.16,39.99 10.09,40 10.02,40.01 7.87,40.13 6.08,40.13 4.62,40.02 3.47,39.86 2.61,39.66 2.01,39.48 1.65,39.33 1.52,39.26 1.48,39.24 1.44,39.21 1.4,39.19 1.36,39.17 1.32,39.14 1.28,39.12 1.24,39.1 1.2,39.07 1.21,39.03 1.22,38.98 1.23,38.94 1.24,38.89 1.25,38.85 1.26,38.8 1.27,38.76 1.28,38.71 1.33,38.53 1.39,38.33 1.45,38.14 1.53,37.94 1.61,37.73 1.69,37.53 1.79,37.31
NC3
  pour Top: 27.42,5.69 27.25,5.72 27.09,5.79 26.91,5.88 26.73,6.01 26.55,6.17 26.37,6.35 26.19,6.56 26.01,6.8 25.66,7.37 25.33,8.03 25.06,8.74 24.85,9.5 24.7,10.29 24.64,11.08 24.67,11.87 24.81,12.63 24.95,13.15 25.11,13.66 25.27,14.15 25.45,14.63 25.64,15.08 25.85,15.52 26.06,15.95 26.28,16.35 26.37,16.52 26.43,16.7 26.47,16.88 26.49,17.06 26.48,17.24 26.45,17.42 26.4,17.59 26.32,17.77 26.28,17.84 26.24,17.9 26.19,17.97 26.14,18.03 26.09,18.09 26.04,18.15 25.98,18.2 25.92,18.25 26.17,18.39 26.43,18.53 26.69,18.67 26.96,18.81 27.22,18.95 27.48,19.08 27.74,19.2 27.97,19.31 28.64,19.59 29.4,19.89 30.24,20.2 31.16,20.52 32.13,20.85 33.14,21.19 34.18,21.52 35.22,21.85 34.99,21.66 34.74,21.46 34.49,21.24 34.23,21.01 33.95,20.77 33.65,20.5 33.34,20.22 33,19.91 32.16,19.1 31.32,18.25 30.5,17.36 29.74,16.48 29.05,15.63 28.46,14.84 27.98,14.13 27.65,13.53 27.56,13.26 27.52,12.98 27.53,12.69 27.58,12.38 27.67,12.07 27.79,11.74 27.92,11.41 28.07,11.06 28.3,10.53 28.5,9.99 28.68,9.42 28.8,8.84 28.85,8.25 28.79,7.63 28.62,7 28.32,6.35 28.21,6.19 28.11,6.05 28,5.93 27.89,5.83 27.77,5.76 27.66,5.72 27.54,5.69
NC4
  pour Top: 10.95,13.5 10.98,13.64 11.06,14.01 11.16,14.58 11.26,15.3 11.36,16.1 11.42,16.95 11.43,17.78 11.37,18.56 11.03,19.96 10.47,21.21 9.71,22.31 8.78,23.26 7.71,24.08 6.53,24.77 5.28,25.33 3.98,25.78 4.12,25.72 4.5,25.54 5.06,25.26 5.76,24.87 6.54,24.39 7.35,23.83 8.13,23.18 8.83,22.47 9.45,21.7 9.95,21 10.35,20.36 10.64,19.74 10.85,19.12 10.99,18.5 11.1,17.12 11.11,16.34 11.09,15.64 11.07,15.03 11.04,14.5 11.01,14.08 10.98,13.76 10.96,13.57
NC5
  pour Top: 12.35,8.97 12.92,10.34 13.39,11.56 13.77,12.66 14.1,13.65 14.4,14.58 14.67,15.46 14.94,16.32 15.24,17.2 15.55,18.12 15.87,19.08 16.22,20.07 16.63,21.08 17.12,22.08 17.72,23.07 18.44,24.02 19.31,24.92 20.06,25.52 20.84,26.01 21.64,26.39 22.45,26.66 23.24,26.82 24.02,26.87 24.76,26.82 25.45,26.66 26.18,26.31 26.75,25.83 27.18,25.24 27.49,24.61 27.69,23.97 27.82,23.37 27.87,22.87 27.88,22.5 27.84,21.96 27.73,21.43 27.59,20.91 27.43,20.44 27.27,20.04 27.13,19.72 27.04,19.52 27,19.44 27.17,19.88 27.3,20.33 27.4,20.79 27.45,21.26 27.46,21.76 27.43,22.28 27.35,22.83 27.23,23.41 27.1,23.78 26.92,24.13 26.67,24.48 26.39,24.79 26.06,25.07 25.72,25.3 25.35,25.47 24.98,25.58 24.24,25.67 23.54,25.67 22.87,25.58 22.23,25.4 21.61,25.14 21.02,24.78 20.44,24.34 19.87,23.8 19.31,23.21 18.77,22.6 18.26,21.93 17.74,21.17 17.22,20.27 16.69,19.21 16.12,17.95 15.52,16.44 15.04,15.23 14.52,13.97 14,12.72 13.49,11.55 13.04,10.52 12.68,9.71 12.43,9.17
NC6
  pour Top: 49.63,24.61 48.42,25.09 47.62,25.23 46.66,25.23 44.87,24.88 43.41,24.29 42.25,23.64 39.03,20.38 36.87,17.92 33.91,14.04 33.1,12.76 32.69,12.01 32.6,11.44 32.61,10.42 32.73,9.09 32.98,7.59 33.24,6.56 33.57,5.48 34,4.43 34.55,3.45 35,3.01 35.6,2.52 36,2.3 36.91,2.04 37.69,2.19 38.09,2.57 38.22,3.37 37.98,4.57 37.66,5.42 37.06,6.46 36.37,7.68 35.91,8.65 35.63,9.71 35.58,10.37 35.77,11.71 36.06,12.53 36.82,13.74 38.99,16.17 41.79,18.85 43.95,20.68 46.78,22.81
NC7
  pour Top: 99.6,11.15 99.51,10.42 99.32,9.78 99,9.26 98.52,8.9 97.93,8.76 97.35,8.84 97.13,8.92 97.53,8.13 98.11,7.08 98.8,6.05 99.6,5.06 100.46,4.18 101.53,3.28 102.86,2.38 103.89,1.82 104.45,1.51 105.51,1.04 106.47,0.69 107.2,0.53 107.62,0.5 107.97,0.55 108.2,0.72 108.29,1.04 108.29,1.31 108.24,1.63 107.93,2.58 107.37,3.72 106.69,4.8 105.9,5.77 105.6,6.07 105.05,6.44 104.08,7.08 102.98,7.85 101.83,8.77 100.83,9.69 100.14,10.46
NC8
  pour Top: 85.61,11.48 84.95,11.15 84.2,11.06 83.62,11.06 83.14,11.15 82.77,11.23 84.13,8.58 84.67,7.69 85.32,6.82 86.06,5.99 86.86,5.26 87.84,4.52 89.07,3.78 90.01,3.33 90.51,3.09 91.48,2.71 92.36,2.45 93.02,2.33 93.4,2.32 93.71,2.38 93.91,2.53 93.99,2.82 93.98,3.05 93.93,3.32 93.63,4.14 93.1,5.12 92.45,6.03 91.72,6.84 91.44,7.09 90.94,7.39 90.06,7.91 89.04,8.55 87.98,9.3 86.83,10.17
PGC
  Bottom 0.5: U$2.12 74.9,17.16 arc92 75.15,16.9 arc-55 75.92,16.52 arc29 76.68,15.89 arc19 77.57,15.63 arc-33 JP5.1
PGD
  Bottom 0.5: U$2.13 73.63,16.78 arc91 74.01,16.4 arc-58 75.66,15.51 arc61 76.68,15 arc-79 JP4.1